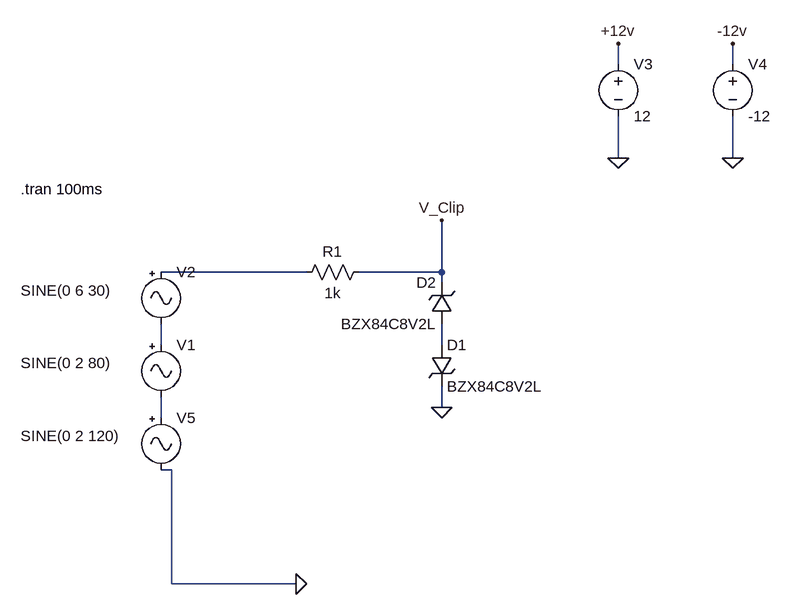
[diagram p0: schematic orgin.asc]
orgin.asc, the LTspice schematic file:
Version 4
SHEET 1 1492 680
WIRE 592 -384 592 -416
WIRE 768 -384 768 -416
WIRE 592 -240 592 -304
WIRE 768 -240 768 -304
WIRE 112 -64 -112 -64
WIRE 320 -64 320 -144
WIRE 320 -64 192 -64
WIRE 320 -48 320 -64
WIRE -112 48 -112 16
WIRE 320 48 320 16
WIRE 320 144 320 112
WIRE -112 160 -112 128
WIRE -96 240 -112 240
WIRE -96 416 -96 240
WIRE 96 416 -96 416
FLAG 96 416 0
FLAG 320 -144 V_Clip
FLAG 592 -416 +12v
FLAG 592 -240 0
FLAG 768 -240 0
FLAG 768 -416 -12v
FLAG 320 144 0
SYMBOL Misc\\signal -112 32 R0
WINDOW 3 -216 44 Left 2
WINDOW 123 0 0 Left 0
WINDOW 39 0 0 Left 0
SYMATTR Value SINE(0 2 80)
SYMATTR InstName V1
SYMBOL res 208 -80 R90
WINDOW 0 0 56 VBottom 2
WINDOW 3 32 56 VTop 2
SYMATTR InstName R1
SYMATTR Value 1k
SYMBOL voltage 592 -400 R0
WINDOW 123 0 0 Left 0
WINDOW 39 0 0 Left 0
SYMATTR InstName V3
SYMATTR Value 12
SYMBOL voltage 768 -400 R0
WINDOW 123 0 0 Left 0
WINDOW 39 0 0 Left 0
SYMATTR InstName V4
SYMATTR Value -12
SYMBOL zener 304 48 R0
SYMATTR InstName D1
SYMATTR Value BZX84C8V2L
SYMBOL zener 336 16 R180
WINDOW 0 24 64 Left 2
WINDOW 3 24 0 Left 2
SYMATTR InstName D2
SYMATTR Value BZX84C8V2L
SYMBOL Misc\\signal -112 -80 R0
WINDOW 3 -216 44 Left 2
WINDOW 123 0 0 Left 0
WINDOW 39 0 0 Left 0
SYMATTR Value SINE(0 6 30)
SYMATTR InstName V2
SYMBOL Misc\\signal -112 144 R0
WINDOW 3 -216 44 Left 2
WINDOW 123 0 0 Left 0
WINDOW 39 0 0 Left 0
SYMATTR Value SINE(0 2 120)
SYMATTR InstName V5
TEXT -328 -192 Left 2 !.tran 100ms

The netlist it stands for:
* orgin.asc
V1 N002 N004 SINE(0 2 80)
R1 V_Clip N001 1k
V3 +12v 0 12
V4 -12v 0 -12
D1 N003 0 BZX84C8V2L
D2 N003 V_Clip BZX84C8V2L
V2 N001 N002 SINE(0 6 30)
V5 N004 0 SINE(0 2 120)
.model D D
.lib standard.dio
.tran 100ms
.backanno
.end